# EAGLE design 6-digit-board (EAGLE 6.4)
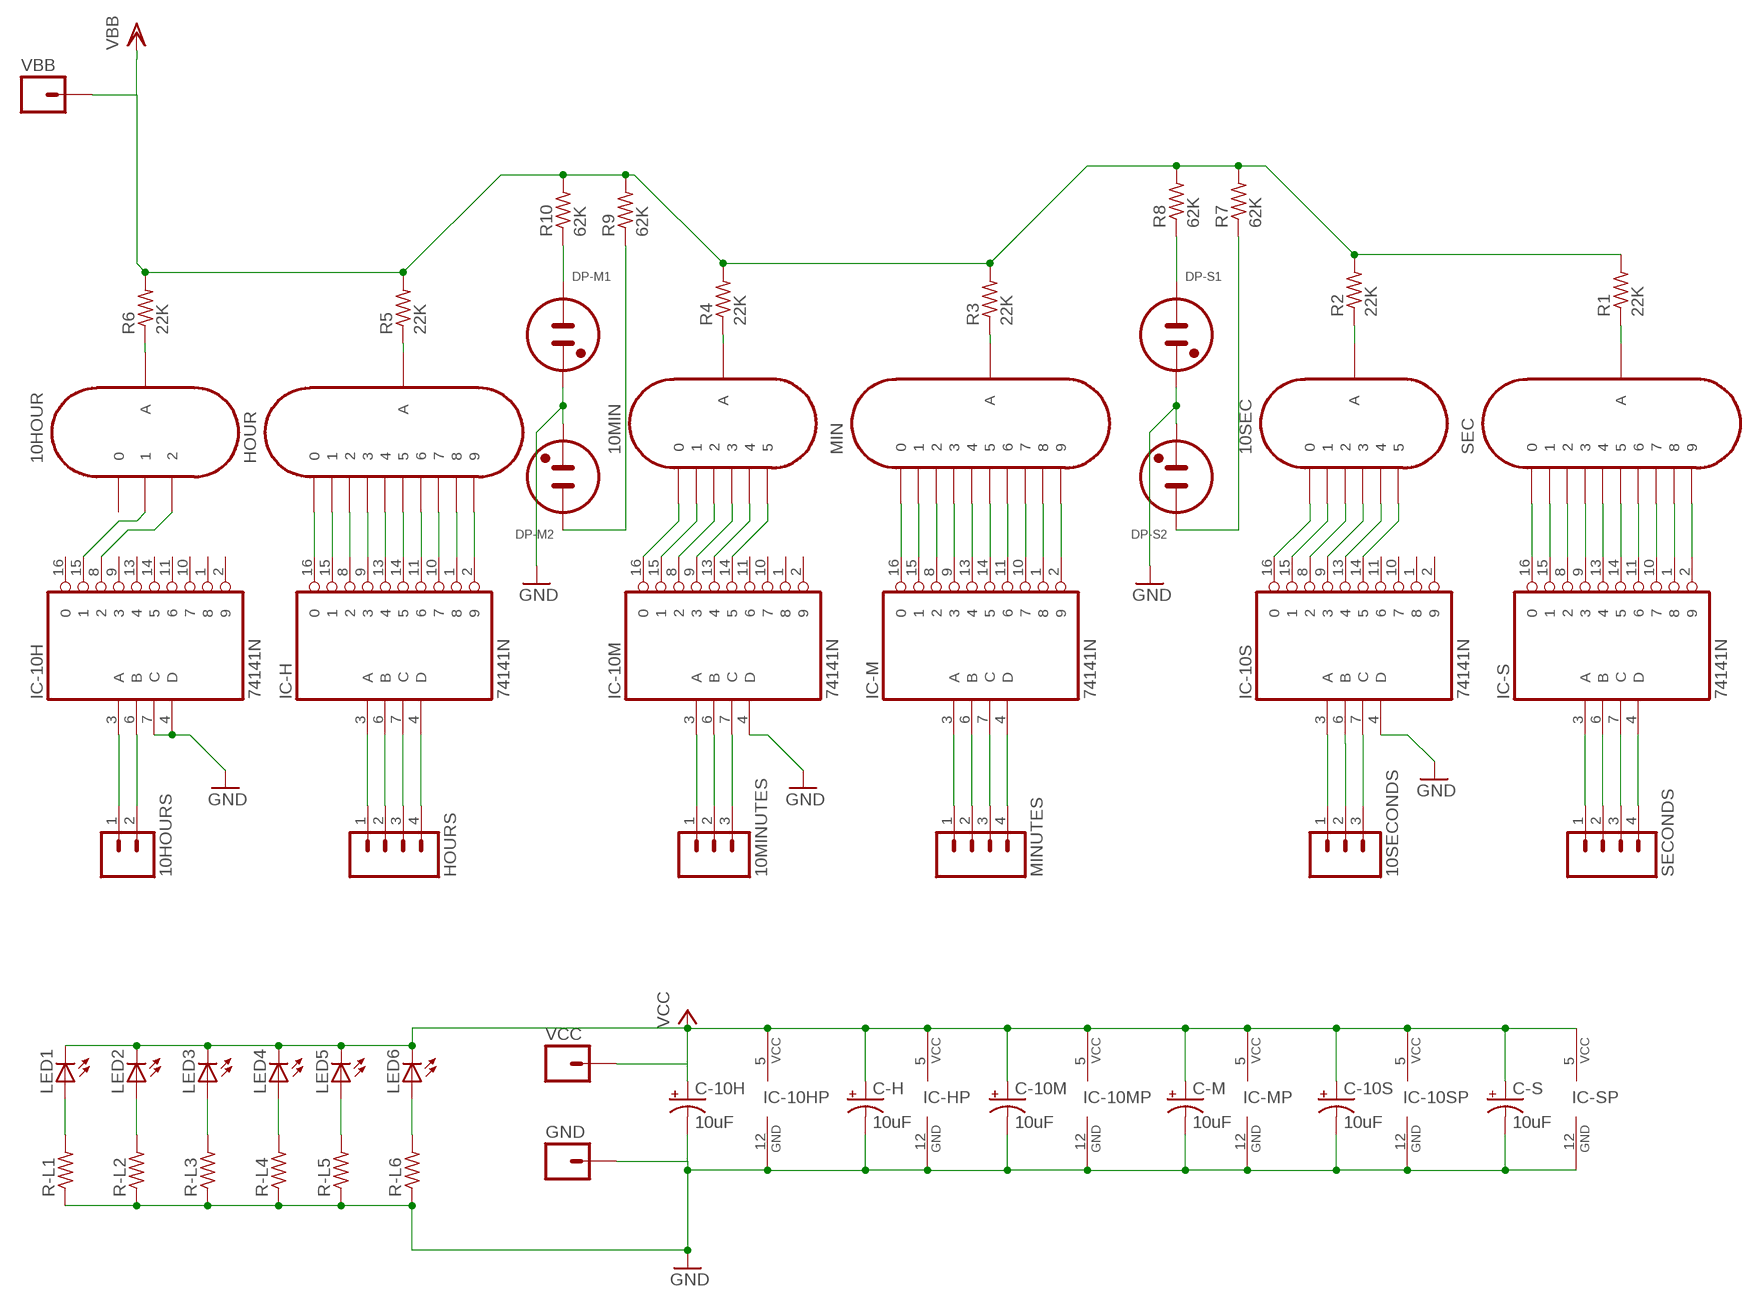
[diagram p0: schematic, sheet 1]

## Parts
10HOUR  IN-12_2DIGIT  [IN-12_2DIGIT]
10HOURS  M02PTH3  [1X02_LONGPADS]
10MIN  IN-12_6DIGIT  [IN-12_6DIGIT]
10MINUTES  M03LONGPADS  [1X03_LONGPADS]
10SEC  IN-12_6DIGIT  [IN-12_6DIGIT]
10SECONDS  M03LONGPADS  [1X03_LONGPADS]
C-10H  10uF  CAPACITOR_POLB/3528-21R  [B/3528-21R]
C-10M  10uF  CAPACITOR_POLB/3528-21R  [B/3528-21R]
C-10S  10uF  CAPACITOR_POLB/3528-21R  [B/3528-21R]
C-H  10uF  CAPACITOR_POLB/3528-21R  [B/3528-21R]
C-M  10uF  CAPACITOR_POLB/3528-21R  [B/3528-21R]
C-S  10uF  CAPACITOR_POLB/3528-21R  [B/3528-21R]
DP-M1  INS-1  [INS-1]
DP-M2  INS-1  [INS-1]
DP-S1  INS-1  [INS-1]
DP-S2  INS-1  [INS-1]
GND  M01PTH  [1X01]
HOUR  IN-12A-NO_DP  [IN-12_NO-DP]
HOURS  M04LONGPADS  [1X04_LONGPADS]
IC-10H  74141N  [DIL16]
IC-10M  74141N  [DIL16]
IC-10S  74141N  [DIL16]
IC-H  74141N  [DIL16]
IC-M  74141N  [DIL16]
IC-S  74141N  [DIL16]
LED1  LED1210  [LED1210]
LED2  LED1210  [LED1210]
LED3  LED1210  [LED1210]
LED4  LED1210  [LED1210]
LED5  LED1210  [LED1210]
LED6  LED1210  [LED1210]
MIN  IN-12A-NO_DP  [IN-12_NO-DP]
MINUTES  M04LONGPADS  [1X04_LONGPADS]
R1  22K  RESISTOR0207/10  [0207/10]
R2  22K  RESISTOR0207/10  [0207/10]
R3  22K  RESISTOR0207/10  [0207/10]
R4  22K  RESISTOR0207/10  [0207/10]
R5  22K  RESISTOR0207/10  [0207/10]
R6  22K  RESISTOR0207/10  [0207/10]
R7  62K  RESISTOR0207/10  [0207/10]
R8  62K  RESISTOR0207/10  [0207/10]
R9  62K  RESISTOR0207/10  [0207/10]
R10  62K  RESISTOR0207/10  [0207/10]
R-L1  RESISTORR1206  [R1206]
R-L2  RESISTORR1206  [R1206]
R-L3  RESISTORR1206  [R1206]
R-L4  RESISTORR1206  [R1206]
R-L5  RESISTORR1206  [R1206]
R-L6  RESISTORR1206  [R1206]
SEC  IN-12A-NO_DP  [IN-12_NO-DP]
SECONDS  M04LONGPADS  [1X04_LONGPADS]
VBB  M01PTH  [1X01]
VCC  M01PTH  [1X01]

## Nets
GND: C-10H.- C-10M.- C-10S.- C-H.- C-M.- C-S.- DP-M1.K DP-M2.K DP-S1.K DP-S2.K GND.1 IC-10H.4(D) IC-10H.7(C) IC-10H.12(GND) IC-10M.4(D) IC-10M.12(GND) IC-10S.4(D) IC-10S.12(GND) IC-H.12(GND) IC-M.12(GND) IC-S.12(GND) R-L1.1 R-L2.1 R-L3.1 R-L4.1 R-L5.1 R-L6.1
N$1: 10HOUR.A R6.1
N$2: HOUR.A R5.1
N$3: 10MIN.A R4.1
N$4: MIN.A R3.1
N$5: 10SEC.A R2.1
N$6: R1.1 SEC.A
N$7: HOURS.1 IC-H.3(A)
N$8: HOURS.2 IC-H.6(B)
N$9: DP-M1.A R10.1
N$10: DP-M2.A R9.1
N$11: DP-S1.A R8.1
N$12: DP-S2.A R7.1
N$13: HOUR.0 IC-H.16
N$14: HOUR.1 IC-H.15
N$15: HOUR.2 IC-H.8
N$16: HOUR.3 IC-H.9
N$17: HOUR.4 IC-H.13
N$18: HOUR.5 IC-H.14
N$19: HOUR.6 IC-H.11
N$20: HOUR.7 IC-H.10
N$21: HOUR.8 IC-H.1
N$22: HOUR.9 IC-H.2
N$23: 10HOUR.1 IC-10H.15
N$25: 10HOUR.2 IC-10H.8
N$26: 10MIN.0 IC-10M.16
N$27: 10MIN.1 IC-10M.15
N$28: 10MIN.2 IC-10M.8
N$29: 10MIN.3 IC-10M.9
N$30: 10MIN.4 IC-10M.13
N$31: 10MIN.5 IC-10M.14
N$32: IC-M.16 MIN.0
N$33: IC-M.15 MIN.1
N$34: IC-M.8 MIN.2
N$35: IC-M.9 MIN.3
N$36: IC-M.13 MIN.4
N$37: IC-M.14 MIN.5
N$38: IC-M.11 MIN.6
N$39: IC-M.10 MIN.7
N$40: IC-M.1 MIN.8
N$41: IC-M.2 MIN.9
N$42: 10SEC.0 IC-10S.16
N$43: 10SEC.1 IC-10S.15
N$44: 10SEC.2 IC-10S.8
N$45: 10SEC.3 IC-10S.9
N$46: 10SEC.4 IC-10S.13
N$47: 10SEC.5 IC-10S.14
N$48: IC-S.16 SEC.0
N$49: IC-S.15 SEC.1
N$50: IC-S.8 SEC.2
N$51: IC-S.9 SEC.3
N$52: IC-S.13 SEC.4
N$53: IC-S.14 SEC.5
N$54: IC-S.11 SEC.6
N$55: IC-S.10 SEC.7
N$56: IC-S.1 SEC.8
N$57: IC-S.2 SEC.9
N$58: HOURS.3 IC-H.7(C)
N$59: HOURS.4 IC-H.4(D)
N$60: IC-S.3(A) SECONDS.1
N$61: IC-S.6(B) SECONDS.2
N$62: IC-S.7(C) SECONDS.3
N$63: IC-S.4(D) SECONDS.4
N$64: IC-M.3(A) MINUTES.1
N$65: IC-M.6(B) MINUTES.2
N$66: IC-M.7(C) MINUTES.3
N$67: IC-M.4(D) MINUTES.4
N$68: 10SECONDS.1 IC-10S.3(A)
N$69: 10SECONDS.2 IC-10S.6(B)
N$70: 10SECONDS.3 IC-10S.7(C)
N$71: 10MINUTES.1 IC-10M.3(A)
N$72: 10MINUTES.2 IC-10M.6(B)
N$73: 10MINUTES.3 IC-10M.7(C)
N$74: 10HOURS.1 IC-10H.3(A)
N$75: 10HOURS.2 IC-10H.6(B)
N$76: LED1.A R-L1.2
N$77: LED2.A R-L2.2
N$78: LED3.A R-L3.2
N$79: LED4.A R-L4.2
N$80: LED5.A R-L5.2
N$81: LED6.A R-L6.2
VBB: R1.2 R2.2 R3.2 R4.2 R5.2 R6.2 R7.2 R8.2 R9.2 R10.2 VBB.1
VCC: C-10H.+ C-10M.+ C-10S.+ C-H.+ C-M.+ C-S.+ IC-10H.5(VCC) IC-10M.5(VCC) IC-10S.5(VCC) IC-H.5(VCC) IC-M.5(VCC) IC-S.5(VCC) LED1.C LED2.C LED3.C LED4.C LED5.C LED6.C VCC.1
Unconnected: 10HOUR.0 IC-10H.1 IC-10H.2 IC-10H.9 IC-10H.10 IC-10H.11 IC-10H.13 IC-10H.14 IC-10H.16 IC-10M.1 IC-10M.2 IC-10M.10 IC-10M.11 IC-10S.1 IC-10S.2 IC-10S.10 IC-10S.11

## Library data of the parts
10HOUR = iStivi - Tubes:IN-12_2DIGIT: IN-12 DIGITS 0-2 IN-12 nixie tube using only pins 0-2 for clock display.
10HOURS = iStivi - Header-Connector:M02: Header 2 Standard 2-pin 0.1" header. Use with straight break away headers (SKU : PRT-00116), right angle break away headers (PRT-00553), swiss pins (PRT-00743), machine pins (PRT-00117), and female headers (PRT-00115). Molex polarized connector foot print use with SKU : PRT-08233 with associated crimp pins and housings.
10MIN 10SEC = iStivi - Tubes:IN-12_6DIGIT: IN-12 DIGITS 0-6 IN-12 pin layout with only the pins 0-5 connected. For clock display.
10MINUTES 10SECONDS = iStivi - Header-Connector:M03: Header 3 Standard 3-pin 0.1" header. Use with straight break away headers (SKU : PRT-00116), right angle break away headers (PRT-00553), swiss pins (PRT-00743), machine pins (PRT-00117), and female headers (PRT-00115). Molex polarized connector foot print use with SKU : PRT-08232 with associated crimp pins and housings.
C-10H C-10M C-10S C-H C-M C-S = iStivi - RCLD:CAPACITOR_POL: POLARIZED CAPACITOR, American symbol
DP-M1 DP-M2 DP-S1 DP-S2 = iStivi - Tubes:INS-1: INS-1 Neon indicator (wire connection)
GND VBB VCC = iStivi - Header-Connector:M01: Header 1 Standard 1-pin 0.1" header. Use with straight break away headers (SKU : PRT-00116), right angle break away headers (PRT-00553), swiss pins (PRT-00743), machine pins (PRT-00117), and female headers (PRT-00115).
HOUR MIN SEC = iStivi - Tubes:IN-12A: IN-12A: medium numeric topview nixie tube
HOURS MINUTES SECONDS = iStivi - Header-Connector:M04: Header 4 Standard 4-pin 0.1" header. Use with straight break away headers (SKU : PRT-00116), right angle break away headers (PRT-00553), swiss pins (PRT-00743), machine pins (PRT-00117), and female headers (PRT-00115). Molex polarized connector foot print use with SKU : PRT-08231 with associated crimp pins and housings. 1MM SMD Version SKU: PRT-10208
IC-10H IC-10M IC-10S IC-H IC-M IC-S = iStivi - ICs:74*141: Nixie Driver BCD to decimal decoder/driver
LED1-LED6 = iStivi - LED:LED: LEDs Standard schematic elements and footprints for 5mm, 3mm, 1206, and 0603 sized LEDs. 5mm - Spark Fun Electronics SKU : COM-00529 (and others)
R1-R10 R-L1-R-L6 = iStivi - RCLD:RESISTOR: RESISTOR

## Board
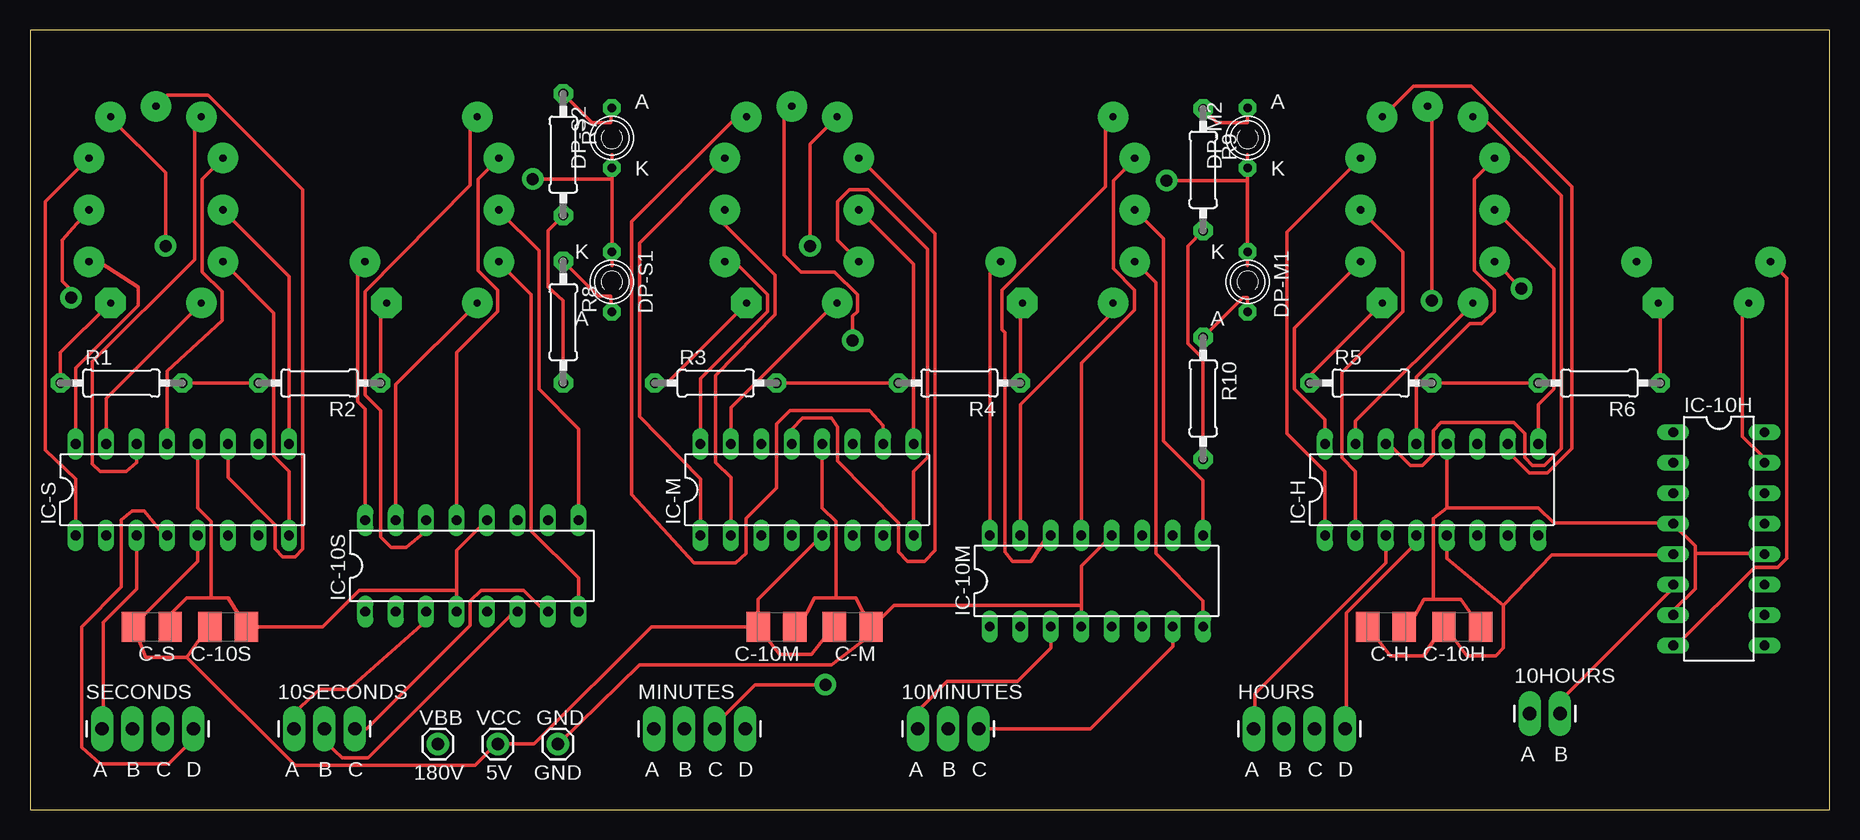
[diagram p1: board, top side]
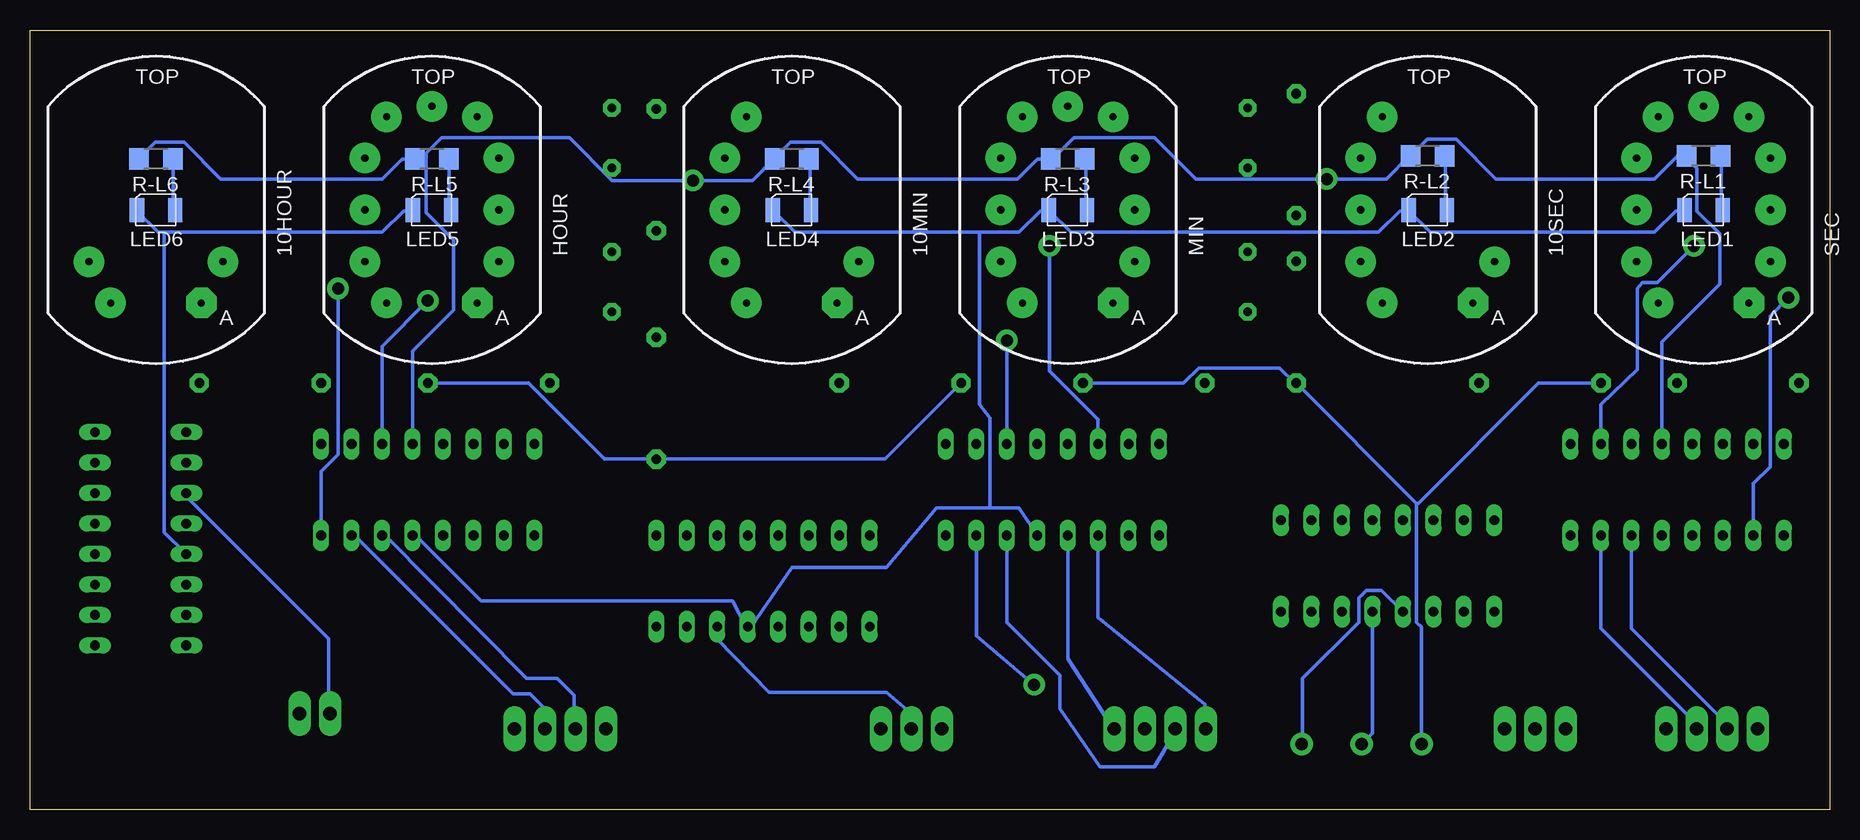
[diagram p2: board, bottom side, seen from below]

Size 150 x 65 mm. Coordinates in mm from the lower left corner, seen from the top.
Outline: 0,0 150,0 150,65 0,65 0,0
Copper layers (1*16): Top 0.035mm / dielectric 1.5mm / Bottom 0.035mm
Design rules "iStivi-1mm via *": minimum track width 12mil, minimum drill 1mm, track to track 10mil, track to pad 10mil, pad to pad 10mil, via to via 1mm, smd to smd 10mil, copper to edge 40mil, drill to drill 8mil, minimum pad ring 10mil, minimum via ring 10mil, stop-mask expansion 0mil, vias tented up to drill 0mil, thermal gap 10mil
bRestrict: area 3.5,52.8 to 6.5,55.8; area 3.5,48.5 to 6.5,51.5; area 3.5,44.2 to 6.5,47.2; area 5.2,40.8 to 8.2,43.8; area 12.8,40.5 to 15.8,43.5; area 14.6,44.1 to 17.6,47.1; area 14.6,48.4 to 17.6,51.4; area 14.6,52.9 to 17.6,55.9; area 12.8,56.2 to 15.8,59.2; area 5.2,56.2 to 8.2,59.2; area 9,57 to 12,60; area 26.5,44.2 to 29.5,47.2; 43 more areas

### Footprints (pad centres in the part's own frame; a part is rotated, then mirrored left to right if it is on the bottom)
IN-12_2DIGIT = drill 0.6 pad 2.54: 0 5.59,-4.32; 1 -3.78,-7.766; 2 -5.59,-4.32 | drill 0.6 pad 2.54 octagon: A 3.78,-7.766
1X02_LONGPADS = drill 1.118 pad 1.88 long: 1 0,0; 2 2.54,0
IN-12_6DIGIT = drill 0.6 pad 2.54: 0 5.59,-4.32; 1 -3.78,-7.766; 2 -5.59,-4.32; 3 -5.59,0; 4 -5.59,4.32; 5 -3.78,7.766 | drill 0.6 pad 2.54 octagon: A 3.78,-7.766
1X03_LONGPADS = drill 1.118 pad 1.88 long: 1 0,0; 2 2.54,0; 3 5.08,0
B/3528-21R = smd 1.95 x 2.5: + 1.525,0; - -1.525,0
INS-1 = drill 0.7 pad 1.422 octagon: A 0,2.5; K 0,-2.5
1X01 = drill 1.016 pad 1.88: 1 0,0
IN-12_NO-DP = drill 0.6 pad 2.54: 0 5.59,-4.32; 1 -3.78,-7.766; 2 -5.59,-4.32; 3 -5.59,0; 4 -5.59,4.32; 5 -3.78,7.766; 6 0,8.64; 7 3.78,7.766; 8 5.59,4.32; 9 5.59,0 | drill 0.6 pad 2.54 octagon: A 3.78,-7.766
1X04_LONGPADS = drill 1.118 pad 1.88 long: 1 0,0; 2 2.54,0; 3 5.08,0; 4 7.62,0
DIL16 = drill 0.813 long: 1 -8.89,-3.81; 2 -6.35,-3.81; 3 -3.81,-3.81; 4 -1.27,-3.81; 5 1.27,-3.81; 6 3.81,-3.81; 7 6.35,-3.81; 8 8.89,-3.81; 9 8.89,3.81; 10 6.35,3.81; 11 3.81,3.81; 12 1.27,3.81; 13 -1.27,3.81; 14 -3.81,3.81; 15 -6.35,3.81; 16 -8.89,3.81
LED1210 = smd 1.2 x 2: A -1.6,0; C 1.6,0
0207/10 = drill 0.8 pad 1.6 octagon: 1 -5.08,0; 2 5.08,0
R1206 = smd 1.6 x 1.803: 1 -1.422,0; 2 1.422,0

### Placement (x,y rotation side)
10HOUR  139.5,50 0 bottom
10HOURS  125,8 0 top
10MIN  86.5,50 0 bottom
10MINUTES  74,6.73 0 top
10SEC  33.5,50 0 bottom
10SECONDS  22,6.73 0 top
C-10H  119.38,15.24 180 top
C-10M  62.23,15.24 180 top
C-10S  16.51,15.24 180 top
C-H  113.03,15.24 180 top
C-M  68.58,15.24 180 top
C-S  10.16,15.24 180 top
DP-M1  101.5,44 180 top
DP-M2  101.5,56 0 top
DP-S1  48.5,44 180 top
DP-S2  48.5,56 0 top
GND  44,5.46 0 top
HOUR  116.5,50 0 bottom
HOURS  102,6.73 0 top
IC-10H  140.78,22.57 270 top
IC-10M  88.9,19.05 0 top
IC-10S  36.83,20.32 0 top
IC-H  116.84,26.67 0 top
IC-M  64.77,26.67 0 top
IC-S  12.7,26.67 0 top
LED1  10.5,50 180 bottom
LED2  33.5,50 180 bottom
LED3  63.5,50 180 bottom
LED4  86.5,50 180 bottom
LED5  116.5,50 180 bottom
LED6  139.5,50 180 bottom
MIN  63.5,50 0 bottom
MINUTES  52,6.73 0 top
R1  7.62,35.56 0 top
R2  24.13,35.56 180 top
R3  57.15,35.56 0 top
R4  77.47,35.56 180 top
R5  111.76,35.56 0 top
R6  130.81,35.56 180 top
R7  44.45,54.61 270 top
R8  44.45,40.64 270 top
R9  97.79,53.34 270 top
R10  97.79,34.29 270 top
R-L1  10.5,54.5 0 bottom
R-L2  33.5,54.5 0 bottom
R-L3  63.5,54.25 0 bottom
R-L4  86.5,54.25 0 bottom
R-L5  116.5,54.25 0 bottom
R-L6  139.5,54.25 0 bottom
SEC  10.5,50 0 bottom
SECONDS  6,6.73 0 top
VBB  34,5.46 0 top
VCC  39,5.46 0 top

### Tracks (layer width: path | path; a pad name or v marks a point on that pad's centre or on a via)
GND  (via drill 1)
  Top 0.305: 87.63,17.02 87.63,20.32 IC-10M.12 | 87.63,17.02 IC-10M.4 | C-10M.- 64.14,15.24 65.41,17.65 67.18,17.65 | 67.18,17.65 68.83,17.65 70.1,15.11 | IC-M.12 66.04,25.15 67.18,24 67.18,17.65 | 87.63,17.02 72.01,17.02 70.23,15.24 C-M.- 70.1,15.11 | C-S.- 11.68,16.26 13.08,17.65 15.11,17.65 | 15.11,17.65 16.51,17.65 C-10S.- 24.38,15.24 27.43,18.29 35.56,18.29 | IC-S.12 13.97,25.15 15.11,24 15.11,17.65 | 35.56,18.29 35.56,21.59 IC-10S.12 | 35.56,18.29 IC-10S.4 | 70.1,15.11 69.98,14.48 66.8,12.06 50.8,12.06 44.07,5.46 GND.1 | 48.51,52.58 48.51,54.61 DP-S2.K | 48.51,52.58 48.51,45.34 DP-S1.K | v41.91,52.58 48.51,52.58 | 138.81,21.34 138.81,21.97 137.03,23.75 IC-10H.4 136.91,23.88 127,23.88 125.73,25.15 118.11,25.15 | 138.81,21.34 138.81,18.41 137.03,16.64 137.03,16.26 IC-10H.7 | 138.81,21.34 144.53,21.34 IC-10H.12 | C-H.- 114.94,15.24 116.2,17.53 116.97,17.53 | 116.97,17.53 119.25,17.53 C-10H.- | 118.11,25.15 IC-H.12 | 118.11,25.15 116.97,24.26 116.97,17.53 | 101.47,52.45 101.47,54.61 DP-M2.K | 101.47,52.45 101.47,45.34 DP-M1.K | v94.74,52.45 101.47,52.45
  Bottom 0.305: IC-10S.4 37.34,18.29 38.61,18.29 39.24,17.65 39.24,15.62 43.94,10.92 43.94,5.46 GND.1 | R-L6.1 140.84,54.36 139.57,55.63 137.16,55.63 134.11,52.58 120.65,52.58 119,54.23 117.98,54.23 R-L5.1 117.86,54.36 117.35,54.36 117.03,54.67 | 117.03,54.67 115.7,56.01 105.03,56.01 101.47,52.45 v94.74,52.45 89.79,52.45 88.01,54.23 R-L4.1 87.88,54.36 86.61,55.63 84.07,55.63 81.03,52.58 67.69,52.58 66.04,54.23 65.02,54.23 R-L3.1 64.77,54.23 62.99,56.01 56.26,56.01 52.83,52.58 v41.91,52.58 36.96,52.58 35.05,54.48 R-L2.1 34.8,54.61 33.53,55.88 31.11,55.88 27.81,52.58 14.61,52.58 12.7,54.48 11.94,54.48 R-L1.1 11.94,54.36 11.05,53.47 11.05,49.91 9.14,48.01 9.14,43.81 13.97,38.99 IC-S.12 | IC-H.12 118.11,38.23 114.68,41.66 114.68,47.5 116.97,49.78 116.97,54.61 117.03,54.67
N$1
  Top 0.305: R6.1 135.89,42.04 135.76,42.16 10HOUR.A
N$2
  Top 0.305: R5.1 106.68,36.2 112.65,42.16 HOUR.A
N$3
  Top 0.305: R4.1 82.55,42.04 82.68,42.16 10MIN.A
N$4
  Top 0.305: R3.1 53.09,35.56 59.69,42.16 MIN.A
N$5
  Top 0.305: R2.1 29.21,41.66 29.72,42.16 10SEC.A
N$6
  Top 0.305: R1.1 2.54,38.1 6.6,42.16 SEC.A
N$7
  Top 0.305: IC-H.3 113.03,20.57 102.11,9.65 102.11,6.73 HOURS.1
N$8
  Bottom 0.305: IC-H.6 120.4,22.86 108.58,10.92 106.05,10.92 104.65,9.53 104.65,6.73 HOURS.2
N$9
  Top 0.305: R10.1 101.09,42.67 101.47,42.67 DP-M1.A
N$10
  Top 0.305: R9.1 98.93,57.28 101.47,57.28 DP-M2.A
N$11
  Top 0.305: R8.1 47.37,42.8 48.39,42.8 DP-S1.A
N$12
  Top 0.305: R7.1 46.86,57.28 48.39,57.28 DP-S2.A
N$13
  Top 0.305: IC-H.16 107.95,32.51 105.41,35.05 105.41,40.13 110.87,45.59 HOUR.0
N$14
  Top 0.305: IC-H.15 110.49,32.38 120.27,42.16 HOUR.1
N$15  (via drill 1)
  Top 0.305: v124.33,43.43 122.17,45.59 HOUR.2
  Bottom 0.305: IC-H.8 125.73,28.19 124.33,29.59 v124.33,43.43
N$16
  Top 0.305: IC-H.9 125.73,33.78 127,35.05 127,45.09 122.17,49.91 HOUR.3
N$17
  Top 0.305: IC-H.13 115.57,36.07 120.02,40.51 121.03,40.51 122.05,41.53 122.05,43.31 120.4,44.96 120.4,52.58 122.05,54.23 HOUR.4
N$18
  Top 0.305: IC-H.14 113.28,30.48 115.06,28.7 116.08,28.7 116.97,29.59 116.97,31.62 117.6,32.26 123.7,32.26 124.59,31.37 124.59,29.34 125.22,28.7 126.24,28.7 127.64,30.1 127.64,51.18 121.16,57.66 120.4,57.66 HOUR.5
N$19  (via drill 1)
  Top 0.305: v116.84,42.42 116.84,58.29 116.59,58.55 HOUR.6
  Bottom 0.305: IC-H.11 120.65,38.61 v116.84,42.42
N$20
  Top 0.305: IC-H.10 123.19,29.84 124.97,28.07 126.49,28.07 128.52,30.1 128.52,51.94 120.14,60.33 115.32,60.33 112.78,57.78 HOUR.7
N$21
  Top 0.305: IC-H.1 107.95,28.19 104.78,31.37 104.78,48.13 110.87,54.23 HOUR.8
N$22
  Top 0.305: IC-H.2 110.49,28.19 109.35,29.34 109.35,36.45 114.43,41.53 114.43,46.48 111,49.91 HOUR.9
N$23
  Top 0.305: IC-10H.15 144.53,28.96 144.53,29.34 142.75,31.11 142.75,41.66 143.26,42.16 10HOUR.1
N$25
  Top 0.305: IC-10H.8 137.03,13.72 137.29,13.72 143.76,20.19 145.67,20.19 146.43,20.95 146.43,44.32 145.16,45.59 10HOUR.2
N$26
  Top 0.305: IC-10M.16 80.01,44.7 80.9,45.59 10MIN.0
N$27
  Top 0.305: IC-10M.15 82.55,33.78 90.17,41.4 90.17,42.16 10MIN.1
N$28
  Top 0.305: IC-10M.8 97.79,17.4 93.85,21.34 93.85,43.94 92.2,45.59 10MIN.2
N$29
  Top 0.305: IC-10M.9 97.79,27.43 94.49,30.73 94.49,47.62 92.2,49.91 10MIN.3
N$30
  Top 0.305: IC-10M.13 87.63,37.21 92.08,41.66 92.08,43.31 90.3,45.09 90.3,52.45 92.08,54.23 10MIN.4
N$31
  Top 0.305: IC-10M.14 84.84,22.86 83.44,20.7 81.92,20.7 81.28,21.46 81.28,39.75 81.03,40.01 81.03,43.31 89.66,51.94 89.66,57.15 90.17,57.66 10MIN.5
N$32
  Top 0.305: IC-M.16 55.88,35.94 61.47,41.53 61.47,42.93 58.8,45.59 57.91,45.59 MIN.0
N$33
  Top 0.305: IC-M.15 58.42,33.53 67.18,42.29 MIN.1
N$34
  Top 0.305: IC-M.8 73.66,28.19 74.8,29.34 74.8,46.74 69.85,51.69 68.33,51.69 67.31,50.67 67.31,47.5 69.09,45.72 MIN.2
N$35
  Top 0.305: IC-M.9 73.66,45.47 69.22,49.91 MIN.3
N$36
  Top 0.305: IC-M.13 63.5,31.75 64.39,32.64 66.8,32.64 67.31,31.88 67.31,29.08 72.39,23.88 72.39,21.46 73.15,20.7 74.55,20.7 75.44,21.59 75.44,48.01 69.22,54.23 MIN.4
N$37  (via drill 1)
  Top 0.305: v65.02,46.99 65.02,55.5 67.18,57.66 MIN.5
  Bottom 0.305: IC-M.14 60.96,32.51 65.02,36.58 v65.02,46.99
N$38  (via drill 1)
  Top 0.305: v68.58,39.12 68.58,41.15 68.96,41.53 68.96,42.93 67.06,44.83 64.26,44.83 62.87,46.23 62.87,57.91 63.5,58.55 MIN.6
  Bottom 0.305: v68.58,39.12 IC-M.11
N$39
  Top 0.305: IC-M.10 71.12,32 69.98,33.27 63.37,33.27 62.23,32.13 62.23,26.8 59.69,24.26 59.69,21.34 58.8,20.57 55.37,20.57 50.16,26.29 50.16,49.02 58.8,57.66 59.69,57.66 MIN.7
N$40
  Top 0.305: IC-M.1 55.88,27.56 50.8,32.77 50.8,47.24 57.78,54.23 MIN.8
N$41
  Top 0.305: IC-M.2 58.42,27.69 57.15,28.96 57.15,36.2 62.1,41.27 62.1,44.58 57.91,48.77 57.91,49.91 MIN.9
N$42
  Top 0.305: IC-10S.16 27.94,33.4 27.3,34.04 27.3,45.09 27.81,45.59 10SEC.0
N$43
  Top 0.305: IC-10S.15 30.48,35.43 37.21,42.16 10SEC.1
N$44
  Top 0.305: IC-10S.8 45.72,19.3 41.78,23.24 41.78,42.93 39.12,45.59 10SEC.2
N$45
  Top 0.305: IC-10S.9 45.72,31.75 42.42,35.05 42.42,46.61 39.12,49.91 10SEC.3
N$46
  Top 0.305: IC-10S.13 35.56,38.1 38.99,41.53 38.99,43.31 37.34,44.96 37.34,52.58 38.99,54.23 10SEC.4
N$47
  Top 0.305: IC-10S.14 33.02,23.24 31.37,21.84 30.1,21.84 29.21,22.73 29.21,33.27 27.94,34.54 27.94,43.18 36.7,52.07 36.7,57.15 37.21,57.66 10SEC.5
N$48
  Top 0.305: IC-S.16 3.81,36.83 9.02,42.04 9.02,43.56 5.84,45.59 4.95,45.59 SEC.0
N$49
  Top 0.305: IC-S.15 6.35,34.29 14.22,42.16 SEC.1
N$50
  Top 0.305: IC-S.8 21.59,28.19 20.32,29.46 20.32,41.4 16.13,45.59 SEC.2
N$51
  Top 0.305: IC-S.9 21.59,44.45 16.13,49.91 SEC.3
N$52
  Top 0.305: IC-S.13 11.43,36.58 16,40.77 16,43.18 14.35,44.83 14.35,52.58 16,54.23 SEC.4
N$53
  Top 0.305: IC-S.14 8.89,28.96 8,28.19 5.84,28.19 5.21,28.83 5.21,37.34 13.72,45.85 13.72,57.15 14.22,57.66 SEC.5
N$54
  Top 0.305: IC-S.11 16.51,27.69 20.45,23.75 20.45,21.72 21.08,21.08 22.1,21.08 22.73,21.72 22.73,51.69 14.86,59.56 11.43,59.56 10.54,58.67 SEC.6
N$55  (via drill 1)
  Top 0.305: v11.3,46.99 11.3,53.09 6.73,57.66 SEC.7
  Bottom 0.305: IC-S.10 19.05,33.78 16,36.7 16,43.43 15.62,43.94 14.35,43.94 v11.3,46.99
N$56
  Top 0.305: IC-S.1 3.81,27.56 1.27,29.97 1.27,50.67 4.83,54.23 SEC.8
N$57  (via drill 1)
  Top 0.305: v3.43,42.67 3.43,43.31 2.67,44.07 2.67,47.5 4.83,49.91 SEC.9
  Bottom 0.305: IC-S.2 6.35,27.18 4.95,28.57 4.95,41.15 v3.43,42.67
N$58
  Bottom 0.305: IC-H.7 122.94,22.86 109.73,9.65 108.33,9.65 107.19,8.51 107.19,6.73 HOURS.3
N$59
  Top 0.305: IC-H.4 115.57,22.23 109.73,16.38 109.73,6.73 HOURS.4
N$60
  Top 0.305: IC-S.3 8.89,18.41 6.1,15.62 6.1,6.73 SECONDS.1
N$61
  Bottom 0.305: IC-S.6 16.51,15.11 8.64,7.24 8.64,6.73 SECONDS.2
N$62
  Bottom 0.305: IC-S.7 19.05,15.11 11.18,7.24 11.18,6.73 SECONDS.3
N$63
  Top 0.305: IC-S.4 11.18,22.86 9.53,24.89 8.51,24.89 7.62,24.13 7.62,18.54 4.32,15.24 4.32,5.21 5.84,3.81 11.56,3.81 13.59,5.84 13.59,6.6 SECONDS.4
N$64
  Bottom 0.305: IC-M.3 60.96,16 52.07,8.76 52.07,6.73 MINUTES.1
N$65
  Bottom 0.305: IC-M.6 68.58,15.62 64.14,11.18 64.14,8.38 60.83,3.56 56.26,3.56 54.61,6.35 54.61,6.6 MINUTES.2
N$66  (via drill 1)
  Top 0.305: v66.29,10.41 60.45,10.41 57.15,7.11 57.15,6.73 MINUTES.3
  Bottom 0.305: IC-M.7 71.12,14.48 v66.29,10.41
N$67
  Bottom 0.305: IC-M.4 63.5,12.57 59.69,6.73 MINUTES.4
N$68
  Top 0.305: IC-10S.3 33.02,15.75 26.54,10.03 24.13,10.03 22.1,8.13 22.1,6.73 10SECONDS.1
N$69
  Top 0.305: IC-10S.6 40.39,16.51 28.19,4.32 26.04,4.32 24.64,5.59 24.64,6.6 10SECONDS.2
N$70
  Top 0.305: IC-10S.7 42.93,16.51 41.15,18.29 37.59,18.29 36.7,17.4 36.7,15.37 28.07,6.73 27.18,6.73 10SECONDS.3
N$71
  Top 0.305: IC-10M.3 85.09,13.46 82.3,10.67 76.45,10.67 74.17,8.38 74.04,6.73 10MINUTES.1
N$72
  Bottom 0.305: IC-10M.6 92.71,14.22 88.39,9.78 78.61,9.78 76.58,8 76.58,6.73 10MINUTES.2
N$73
  Top 0.305: IC-10M.7 95.25,13.59 88.39,6.73 79.12,6.73 10MINUTES.3
N$74
  Bottom 0.305: IC-10H.3 136.91,26.29 136.91,26.04 125.09,14.22 125.09,8 10HOURS.1
N$75
  Top 0.305: IC-10H.6 136.91,18.67 136.91,18.41 127.64,9.14 127.64,8 10HOURS.2
N$76
  Bottom 0.305: R-L1.2 9.02,54.48 9.02,50.04 LED1.A
N$77
  Bottom 0.305: R-L2.2 32,54.48 32,50.04 LED2.A
N$78
  Bottom 0.305: R-L3.2 61.98,54.23 61.98,50.04 LED3.A
N$79
  Bottom 0.305: R-L4.2 84.96,54.23 84.96,50.04 LED4.A
N$80
  Bottom 0.305: R-L5.2 115.06,54.23 115.06,50.16 114.94,50.04 LED5.A
N$81
  Bottom 0.305: R-L6.2 138.05,54.23 138.05,50.16 137.92,50.04 LED6.A
VBB
  Top 0.305: R6.2 R5.2 | R10.2 97.79,37.59 96.52,38.86 96.52,46.99 R9.2 | R4.2 R3.2 | R2.2 R1.2 | R8.2 44.45,42.42 43.18,43.56 43.18,48.26 R7.2
  Bottom 0.305: R5.2 108.46,35.56 102.11,29.21 R10.2 78.74,29.21 R4.2 | 34.42,25.53 34.42,15.62 34.04,15.24 34.04,5.46 VBB.1 | 34.42,25.53 R8.2 44.58,35.56 45.85,36.83 52.58,36.83 53.85,35.56 R3.2 | R2.2 24.26,35.56 34.29,25.53 34.42,25.53
VCC
  Top 0.305: C-H.+ 113.41,12.83 116.2,12.83 117.73,15.24 C-10H.+ 117.98,15.24 119.76,12.83 122.17,12.83 122.81,13.46 122.81,17.02 | IC-H.5 118.11,20.95 122.81,17.02 | 122.81,17.02 126.87,21.21 136.91,21.21 IC-10H.5 | 13.08,12.7 9.65,12.7 C-S.+ 8.64,15.37 13.97,20.7 IC-S.5 | 13.08,12.7 14.86,15.24 C-10S.+ | C-10M.+ 62.48,12.95 65.15,12.95 66.93,15.24 C-M.+ | IC-M.5 60.71,17.53 60.71,15.37 C-10M.+ | C-10M.+ 51.82,15.24 42.04,5.46 39.12,5.46 VCC.1 38.86,5.46 37.08,3.68 22.1,3.68 13.08,12.7
  Bottom 0.305: LED1.C 12.19,49.91 12.83,49.91 14.61,48.13 33.27,48.13 35.05,49.91 LED2.C 35.18,49.91 35.81,49.91 37.59,48.13 63.25,48.13 65.02,49.91 LED3.C 65.15,49.91 65.79,49.91 67.56,48.13 70.87,48.13 | 70.87,48.13 86.23,48.13 LED4.C | 138.81,48.13 139.32,48.13 141.1,49.91 LED6.C | 138.81,48.13 120.65,48.13 118.87,49.91 118.11,49.91 LED5.C | 138.81,48.13 138.81,23.11 137.03,21.34 IC-10H.5 | IC-10S.5 38.1,6.35 38.99,5.46 VCC.1 | 69.98,25.15 67.56,25.15 IC-M.5 | 69.98,25.15 74.42,25.15 78.61,20.19 86.49,20.19 89.92,15.24 IC-10M.5 90.3,15.24 91.44,17.4 112.39,17.4 117.86,22.86 IC-H.5 | 70.87,48.13 70.87,33.78 69.98,32.64 69.98,25.15

### Text on the board
tNames: A | B | A | B | C | D | A | B | C | A | B | C | D | A | B | C | A | B | C | D | 180V | 5V | GND